# EAGLE design DROduino_v1 (EAGLE 6.5.0)
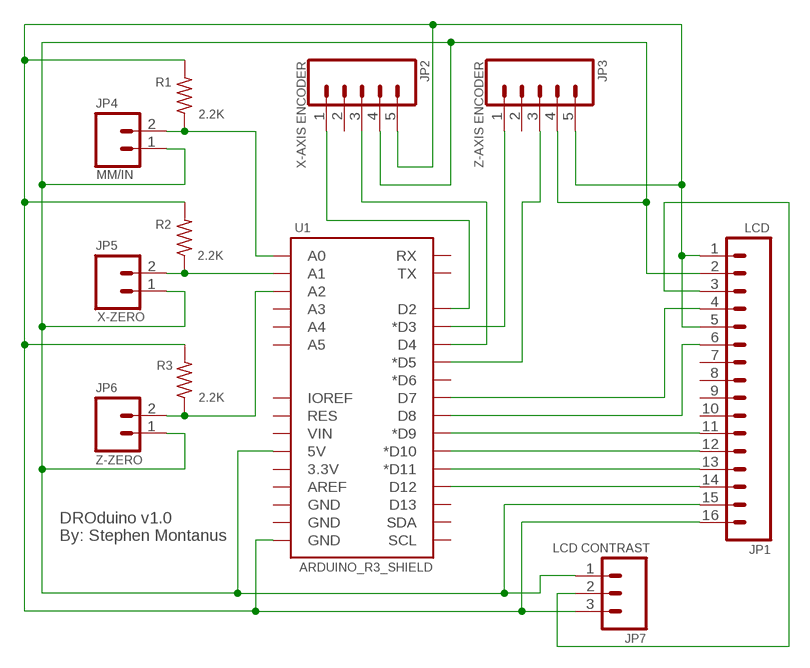
[diagram p0: schematic, sheet 1]

## Parts
JP1  LCD  M16PTH  [1X16]
JP2  X-AXIS ENCODER  M05PTH  [1X05]
JP3  Z-AXIS ENCODER  M05PTH  [1X05]
JP4  MM/IN  M02PTH  [1X02]
JP5  X-ZERO  M02PTH  [1X02]
JP6  Z-ZERO  M02PTH  [1X02]
JP7  LCD CONTRAST  M03PTH  [1X03]
R1  2.2K  R-US_0207/10  [0207/10]
R2  2.2K  R-US_0207/10  [0207/10]
R3  2.2K  R-US_0207/10  [0207/10]
U1  ARDUINO_R3_SHIELD  [UNO_R3_SHIELD]

## Nets
N$1: JP1.14 U1.D12
N$2: JP1.13 U1.D11(*D11)
N$3: JP1.12 U1.D10(*D10)
N$4: JP1.11 U1.D9(*D9)
N$5: JP1.6 U1.D8
N$6: JP1.4 U1.D7
N$8: JP1.3 JP7.2
N$9: JP2.1 U1.D2
N$10: JP2.3 U1.D4
N$11: JP3.1 U1.D3(*D3)
N$12: JP3.3 U1.D5(*D5)
N$13: JP1.1 JP1.5 JP1.16 JP2.5 JP3.5 JP7.3 R1.2 R2.2 R3.2 U1.GND@0(GND)
N$15: JP4.2 R1.1 U1.A0
N$16: JP6.2 R3.1 U1.A2
N$17: JP5.2 R2.1 U1.A1
N$19: JP1.2 JP1.15 JP2.4 JP3.4 JP4.1 JP5.1 JP6.1 JP7.1 U1.5V
Unconnected: JP1.7 JP1.8 JP1.9 JP1.10 JP2.2 JP3.2 U1.3.3V U1.A3 U1.A4 U1.A5 U1.AREF U1.D6(*D6) U1.D13 U1.GND@1(GND) U1.GND@2(GND) U1.IOREF U1.RES U1.RX U1.SCL U1.SDA U1.TX U1.VIN

## Notes on the sheet
- DROduino v1.0
  By: Stephen Montanus

## Library data of the parts
JP1 = SparkFun-Connectors:M16: 1x16 .1" header
JP2 JP3 = SparkFun-Connectors:M05: Header 5 Standard 5-pin 0.1" header. Use with straight break away headers (SKU : PRT-00116), right angle break away headers (PRT-00553), swiss pins (PRT-00743), machine pins (PRT-00117), and female headers (PRT-00115). Molex polarized connector foot print use with SKU : PRT-08230 with associated crimp pins and housings.
JP4-JP6 = SparkFun-Connectors:M02: Standard 2-pin 0.1" header. Use with - straight break away headers ( PRT-00116) - right angle break away headers (PRT-00553) - swiss pins (PRT-00743) - machine pins (PRT-00117) - female headers (PRT-00115) Molex polarized connector foot print use with: PRT-08233 with associated crimp pins and housings. 2.54_SCREWTERM for use with PRT-10571. 3.5mm Screw Terminal footprints for PRT-08084 5mm Screw Terminal footprints for use with PRT-08433
JP7 = SparkFun-Connectors:M03: Header 3 Standard 3-pin 0.1" header. Use with straight break away headers (SKU : PRT-00116), right angle break away headers (PRT-00553), swiss pins (PRT-00743), machine pins (PRT-00117), and female headers (PRT-00115). Molex polarized connector foot print use with SKU : PRT-08232 with associated crimp pins and housings.
R1-R3 = resistor:R-US_: RESISTOR, American symbol
U1 = SparkFun-Boards:ARDUINO_R3_SHIELD: Shield form compatible with the Arduino Uno R3.

## Board
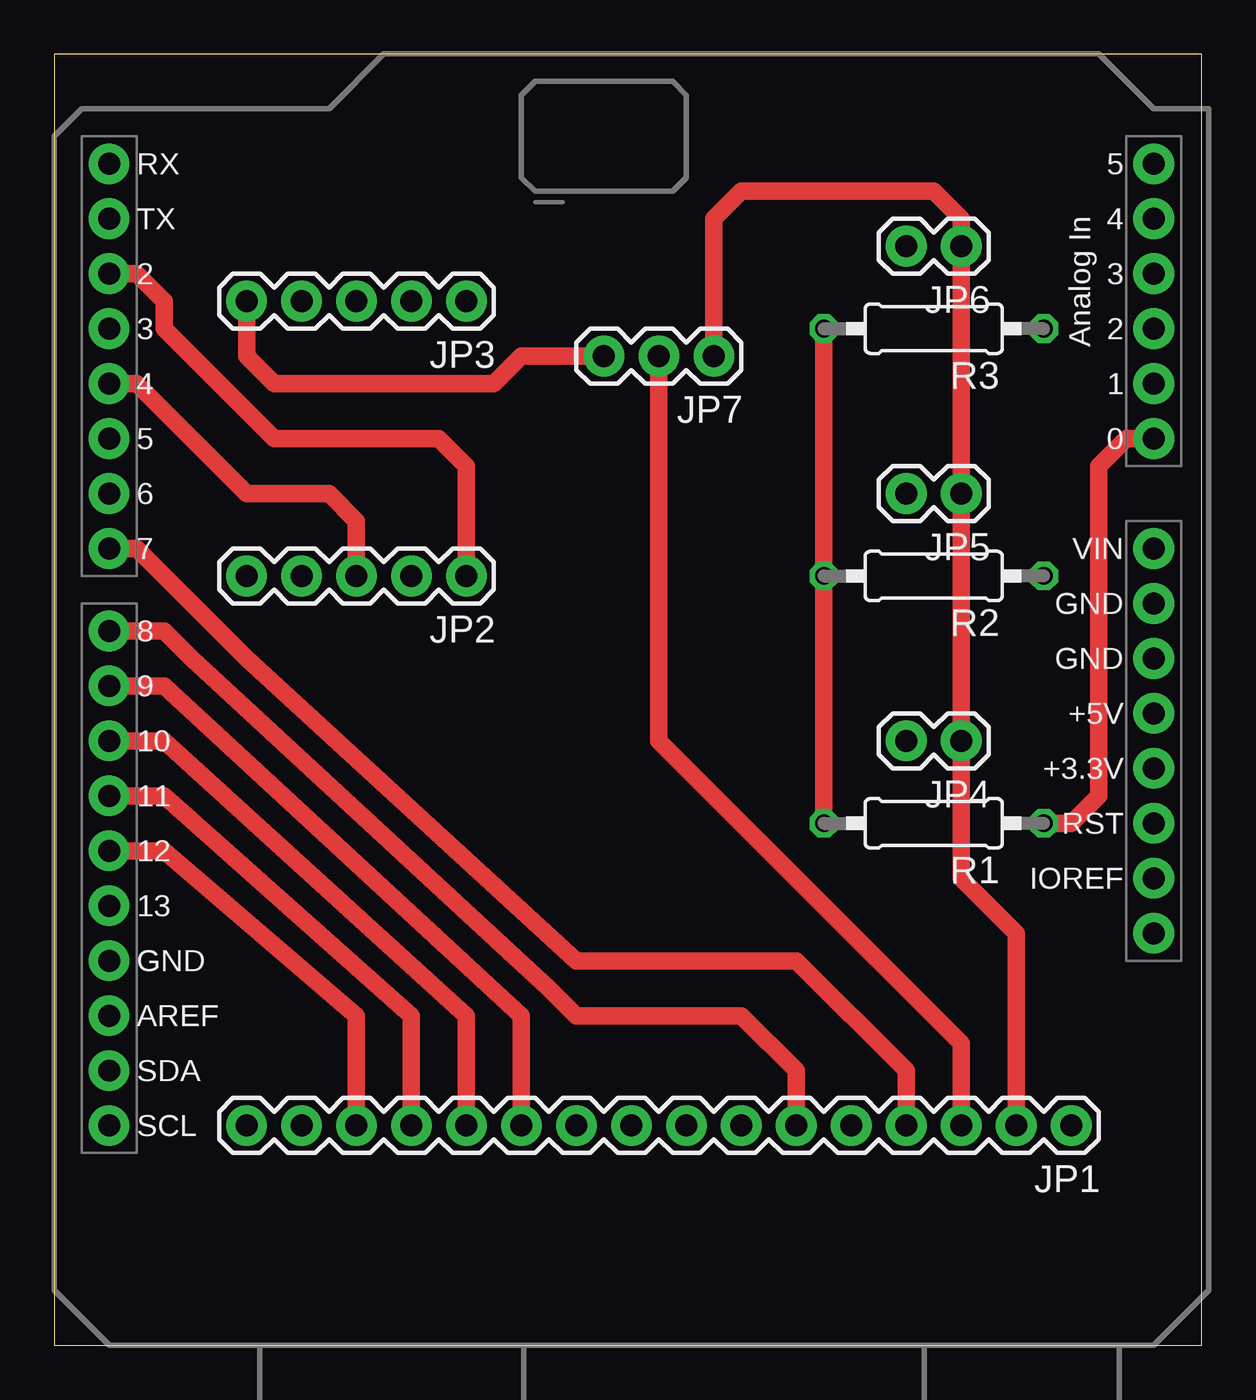
[diagram p1: board, top side]
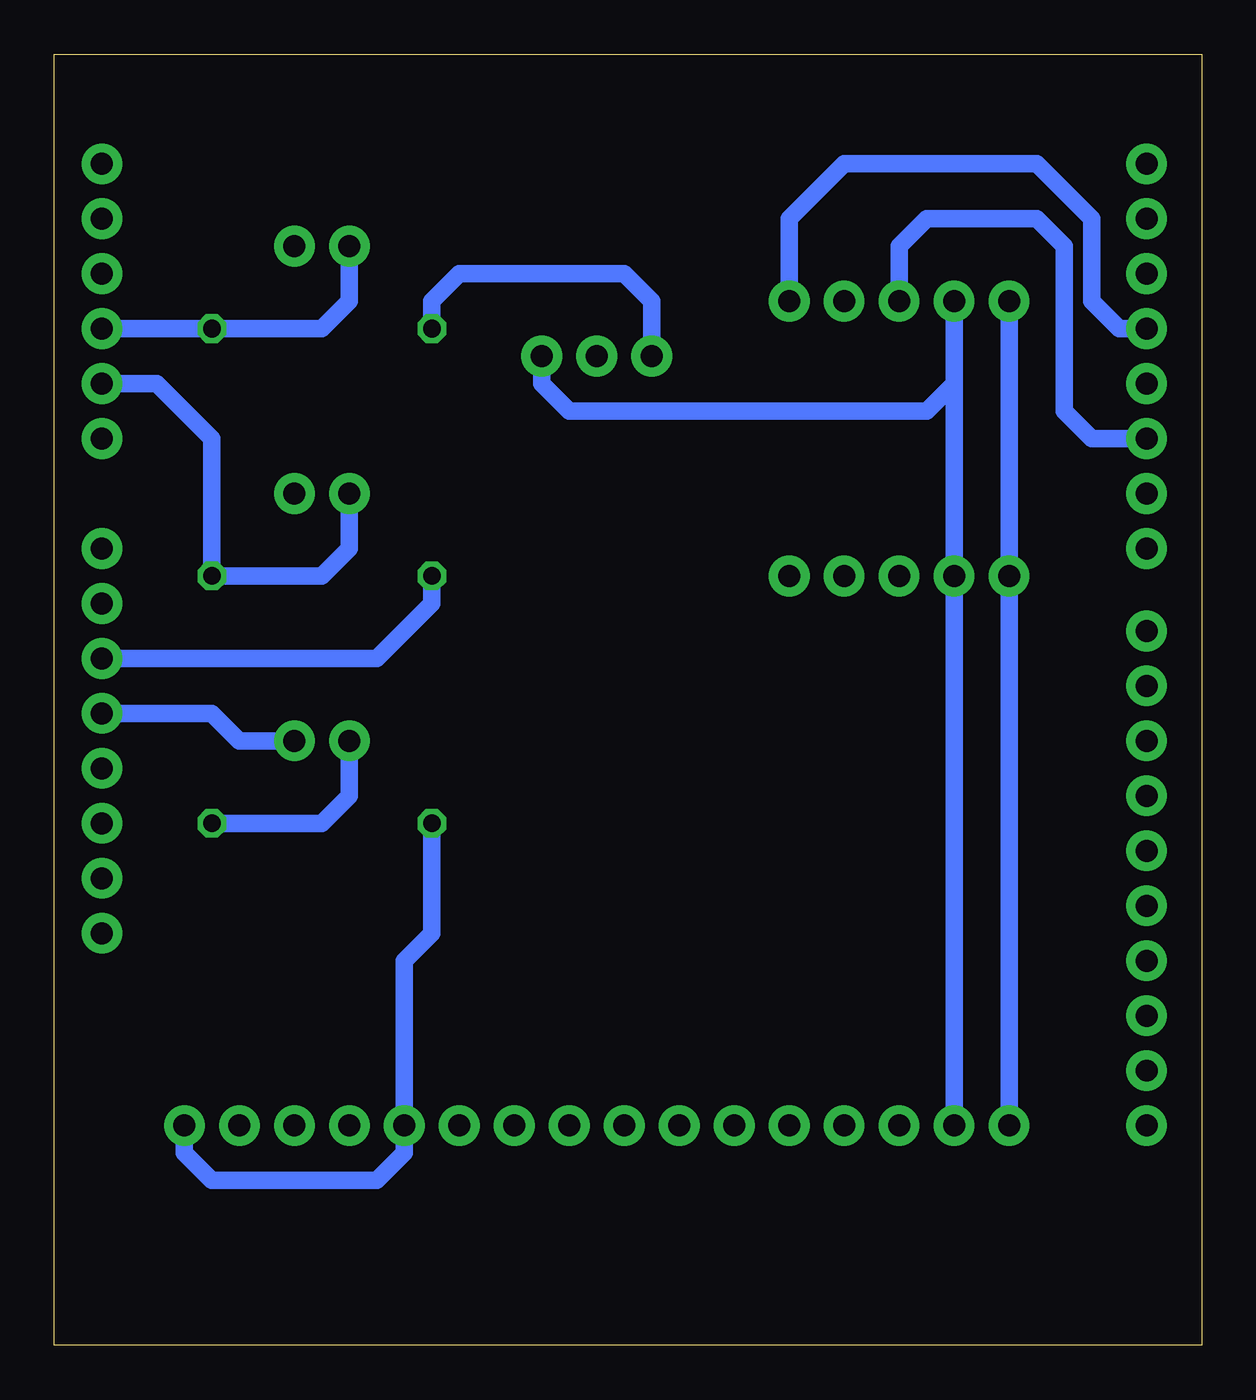
[diagram p2: board, bottom side, seen from below]

Size 53.01 x 59.68 mm. Coordinates in mm from the lower left corner, seen from the top.
Outline: 0,0 53.01,0 53.01,59.68 0,59.68 0,0
Copper layers (1*16): Top 0.035mm / dielectric 1.5mm / Bottom 0.035mm
Design rules "default": minimum track width 10mil, minimum drill 24mil, track to track 8mil, track to pad 8mil, pad to pad 8mil, via to via 8mil, smd to smd 8mil, copper to edge 40mil, drill to drill 8mil, minimum pad ring 10mil, minimum via ring 8mil, stop-mask expansion 4mil, vias tented up to drill 0mil, thermal gap 10mil

### Footprints (pad centres in the part's own frame; a part is rotated, then mirrored left to right if it is on the bottom)
1X16 = drill 1.016 pad 1.88: 1 0,0; 2 2.54,0; 3 5.08,0; 4 7.62,0; 5 10.16,0; 6 12.7,0; 7 15.24,0; 8 17.78,0; 9 20.32,0; 10 22.86,0; 11 25.4,0; 12 27.94,0; 13 30.48,0; 14 33.02,0; 15 35.56,0; 16 38.1,0
1X05 = drill 1.016 pad 1.88: 1 0,0; 2 2.54,0; 3 5.08,0; 4 7.62,0; 5 10.16,0
1X02 = drill 1.016 pad 1.88: 1 0,0; 2 2.54,0
1X03 = drill 1.016 pad 1.88: 1 0,0; 2 2.54,0; 3 5.08,0
0207/10 = drill 0.813 octagon: 1 -5.08,0; 2 5.08,0
UNO_R3_SHIELD = drill 1.016 pad 1.88: 3.3V 50.8,26.67; 5V 50.8,29.21; A0 50.8,41.91; A1 50.8,44.45; A2 50.8,46.99; A3 50.8,49.53; A4 50.8,52.07; A5 50.8,54.61; AREF 2.54,15.24; D2 2.54,49.53; D3 2.54,46.99; D4 2.54,44.45; D5 2.54,41.91; D6 2.54,39.37; D7 2.54,36.83; D8 2.54,33.02; D9 2.54,30.48; D10 2.54,27.94; D11 2.54,25.4; D12 2.54,22.86; D13 2.54,20.32; GND@0 50.8,31.75; GND@1 50.8,34.29; GND@2 2.54,17.78; IOREF 50.8,21.59; NC 50.8,19.05; RES 50.8,24.13; RX 2.54,54.61; SCL 2.54,10.16; SDA 2.54,12.7; TX 2.54,52.07; VIN 50.8,36.83

### Placement (x,y rotation side)
JP1  46.99,10.16 180 top
JP2  19.05,35.56 180 top
JP3  19.05,48.26 180 top
JP4  41.91,27.94 180 top
JP5  41.91,39.37 180 top
JP6  41.91,50.8 180 top
JP7  30.48,45.72 180 top
R1  40.64,24.13 180 top
R2  40.64,35.56 180 top
R3  40.64,46.99 180 top
U1  0,0 0 top

### Tracks (layer width: path | path; a pad name or v marks a point on that pad's centre or on a via)
N$1
  Top 0.813: JP1.14 13.97,15.24 5.08,22.86 U1.D12
N$2
  Top 0.813: JP1.13 16.51,15.24 5.08,25.4 U1.D11
N$3
  Top 0.813: JP1.12 19.05,15.24 5.08,27.94 U1.D10
N$4
  Top 0.813: JP1.11 21.59,15.24 5.08,30.48 U1.D9
N$5
  Top 0.813: JP1.6 34.29,12.7 31.75,15.24 24.13,15.24 22.86,16.51 6.35,31.75 5.08,33.02 U1.D8
N$6
  Top 0.813: U1.D7 3.81,36.83 8.89,31.75 24.13,17.78 34.29,17.78 39.37,12.7 JP1.4
N$8
  Top 0.813: JP1.3 41.91,13.97 27.94,27.94 JP7.2
N$9
  Top 0.813: JP2.1 19.05,40.64 17.78,41.91 10.16,41.91 5.08,46.99 5.08,48.26 3.81,49.53 U1.D2
N$10
  Top 0.813: JP2.3 13.97,38.1 12.7,39.37 8.89,39.37 3.81,44.45 U1.D4
N$11
  Bottom 0.813: JP3.1 19.05,52.07 16.51,54.61 7.62,54.61 5.08,52.07 5.08,48.26 3.81,46.99 U1.D3
N$12
  Bottom 0.813: JP3.3 13.97,50.8 12.7,52.07 7.62,52.07 6.35,50.8 6.35,43.18 5.08,41.91 U1.D5
N$13
  Top 0.813: R1.2 R2.2 R3.2 | JP7.3 21.59,45.72 20.32,44.45 10.16,44.45 8.89,45.72 JP3.5
  Bottom 0.813: JP1.16 JP2.5 JP3.5 | JP1.1 46.99,8.89 45.72,7.62 38.1,7.62 36.83,8.89 JP1.5 36.83,17.78 35.56,19.05 R1.2 | U1.GND@0 38.1,31.75 35.56,34.29 R2.2 | R3.2 35.56,48.26 34.29,49.53 26.67,49.53 25.4,48.26 JP7.3
N$15
  Top 0.813: U1.A0 49.53,41.91 48.26,40.64 48.26,25.4 46.99,24.13 R1.1
  Bottom 0.813: JP4.2 39.37,25.4 40.64,24.13 R1.1
N$16
  Bottom 0.813: U1.A2 R3.1 40.64,46.99 39.37,48.26 JP6.2
N$17
  Bottom 0.813: U1.A1 48.26,44.45 45.72,41.91 R2.1 40.64,35.56 39.37,36.83 JP5.2
N$19
  Top 0.813: JP1.2 44.45,19.05 41.91,21.59 JP4.1 JP5.1 JP6.1 41.91,52.07 40.64,53.34 31.75,53.34 30.48,52.07 JP7.1
  Bottom 0.813: JP1.15 JP2.4 11.43,44.45 | JP4.1 44.45,27.94 45.72,29.21 U1.5V | 11.43,44.45 JP3.4 | JP7.1 30.48,44.45 29.21,43.18 12.7,43.18 11.43,44.45